# Altium schematic sheet zigbee.SchDoc
size A3
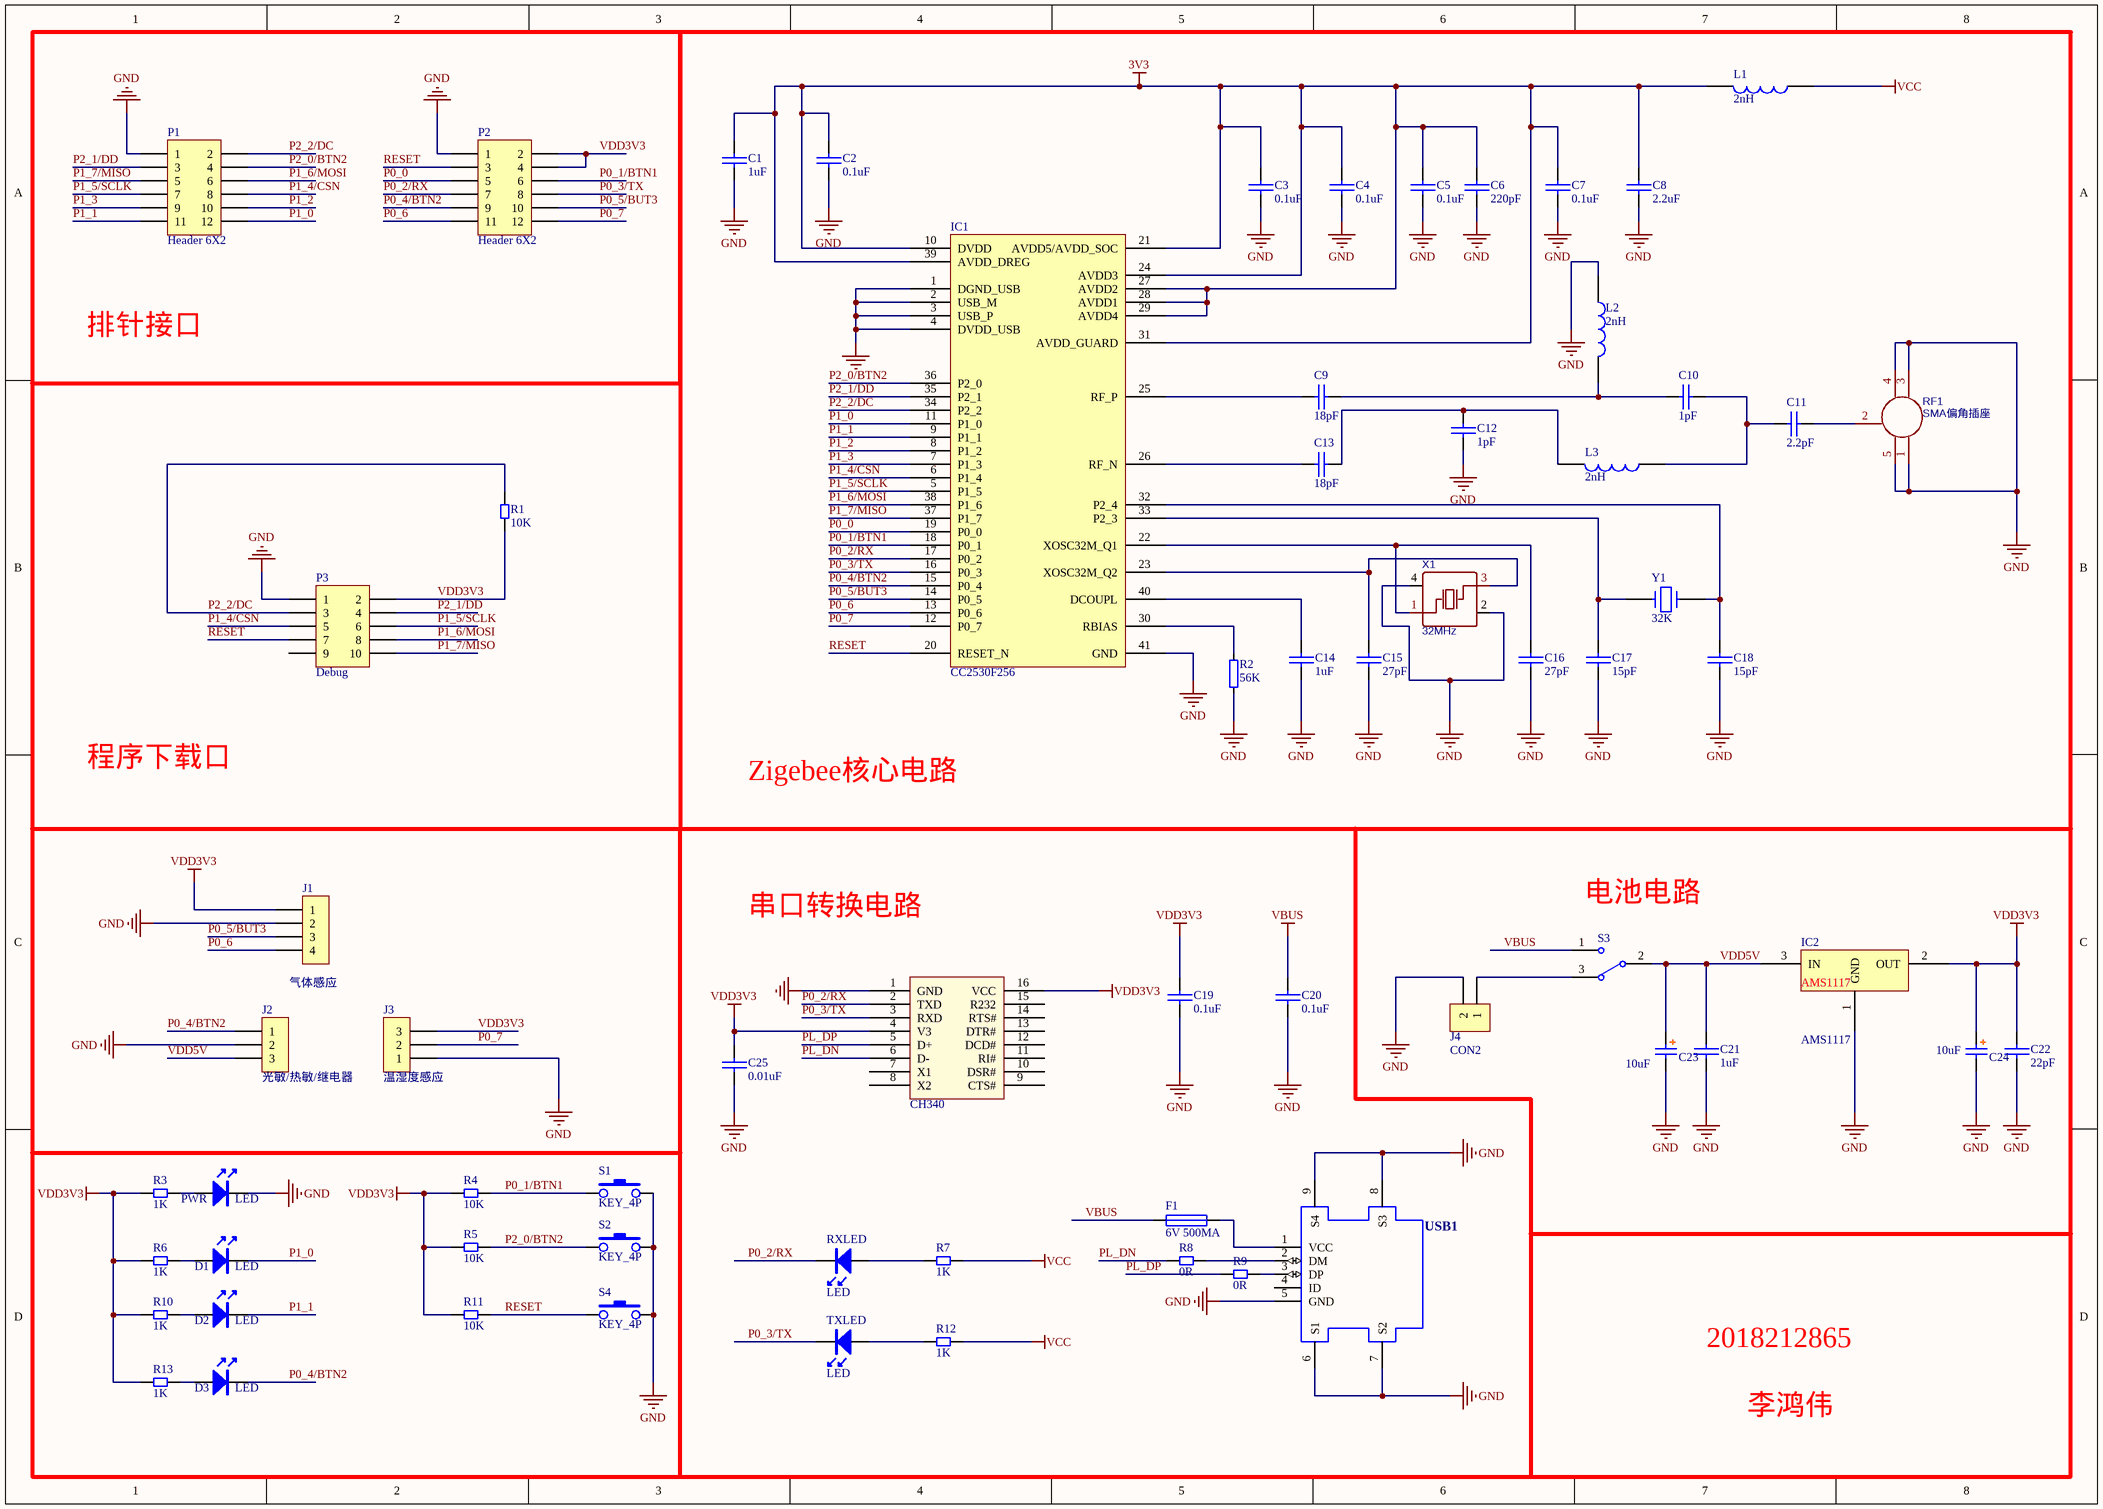
[diagram p0: zigbee.SchDoc]

## Parts
C1  1uF  [C0603]
C2  0.1uF  [C0603]
C3  0.1uF  [C0603]
C4  0.1uF  [C0603]
C5  0.1uF  [C0603]
C6  220pF  [C0603]
C7  0.1uF  [C0603]
C8  2.2uF  [C0603]
C9  18pF  [C0603]
C10  1pF  [C0603]
C11  2.2pF  [C0603]
C12  1pF  [C0603]
C13  18pF  [C0603]
C14  1uF  [C0603]
C15  27pF  [C0603]
C16  27pF  [C0603]
C17  15pF  [C0603]
C18  15pF  [C0603]
C19  0.1uF  [C0603]
C20  0.1uF  [C0603]
C21  1uF  [C0603]
C22  22pF  [C0603]
C23  10uF  [CASE-A_3216]
C24  10uF  [CASE-A_3216]
C25  0.01uF  [C0603]
CH340  CH340G  [SOP16]  (value not drawn)
D1  LED  [LED_0603]
D2  LED  [LED_0603]
D3  LED  [LED_0603]
F1  6V 500MA  [FU 0603]
IC1  CC2530F256  [PVQFN-N40]
IC2  AMS1117  [SOT-223-4]
J1  气体感应  [HDR2.54-M-LI-4P]
J2  光敏/热敏/继电器  [HDR2.54-M-LI-3P]
J3  温湿度感应  [HDR2.54-M-LI-3P]
J4  CON2  [5557-2P]
L1  2nH  [0402]
L2  2nH  [0402]
L3  2nH  [0402]
P1  Header 6X2  [HDR2.54-LI-2x6P]
P2  Header 6X2  [HDR2.54-LI-2x6P]
P3  Debug  [HDR2.54-LI-2x5P]
PWR  LED  [LED_0603]
R1  10K  [R0603]
R2  56K  [R0603]
R3  1K  [R0603]
R4  10K  [R0603]
R5  10K  [R0603]
R6  1K  [R0603]
R7  1K  [R0603]
R8  0R  [R0603]
R9  0R  [R0603]
R10  1K  [R0603]
R11  10K  [R0603]
R12  1K  [R0603]
R13  1K  [R0603]
RF1  SMA偏角插座  [SMA-SMD_HJ-SMA716]
RXLED  LED  [LED_0603]
S1  KEY_4P  [KEY_6*6]
S2  KEY_4P  [KEY_6*6]
S3  SW-SPDT  [SS-12F23]  (value not drawn)
S4  KEY_4P  [KEY_6*6]
TXLED  LED  [LED_0603]
USB1  Mini USB  [SMT-MINI USB]  (value not drawn)
X1  32MHz  [OSC-SMD_4P-L3.2-W2.5-BL]
Y1  32K  [OSC 3215-2P]

## Blocks framed on the sheet
排针接口: P1 P2
Zigebee核心电路: C1-C18 IC1 L1-L3 R2 RF1 X1 Y1

## Nets
3V3: C1.1 C2.1 C3.1 C4.1 C5.1 C6.1 C7.1 C8.1 IC1.10(DVDD) IC1.21(AVDD5/AVDD_SOC) IC1.24(AVDD3) IC1.27(AVDD2) IC1.28(AVDD1) IC1.29(AVDD4) IC1.31(AVDD_GUARD) IC1.39(AVDD_DREG) L1.2
GND: C1.2 C2.2 C3.2 C4.2 C5.2 C6.2 C7.2 C8.2 C12.1 C14.2 C15.2 C16.2 C17.2 C18.2 C19.2 C20.2 C21.2 C22.2 C23.2 C24.2 C25.2 CH340.1(GND) IC1.1(DGND_USB) IC1.2(USB_M) IC1.3(USB_P) IC1.4(DVDD_USB) IC1.41(GND) IC2.1(GND) J1.2 J2.2 J3.1 J4.2 L2.1 P1.1 P2.1 P3.1 PWR.2 R2.1 RF1.1 RF1.3 RF1.4 RF1.5 S1.2 S2.2 S4.2 USB1.5(GND) USB1.6(S1) USB1.7(S2) USB1.8(S3) USB1.9(S4) X1.2(GND) X1.4(GND)
VBUS: C20.1 F1.1 S3.1
VCC: L1.1 R7.2 R12.2
VDD3V3: C19.1 C22.1 C24.1 C25.1 CH340.4(V3) CH340.16(VCC) IC2.2(OUT) J1.1 J3.3 P2.2 P2.4 P3.2 R1.1 R3.1 R4.1 R5.1 R6.1 R10.1 R11.1 R13.1
P0_0: IC1.19(P0_0) P2.5
P0_1/BTN1: IC1.18(P0_1) P2.6 R4.2 S1.1
P0_2/RX: CH340.2(TXD) IC1.17(P0_2) P2.7 RXLED.2
P0_3/TX: CH340.3(RXD) IC1.16(P0_3) P2.8 TXLED.2
P0_4/BTN2: D3.2 IC1.15(P0_4) J2.1 P2.9
P0_5/BUT3: IC1.14(P0_5) J1.3 P2.10
P0_6: IC1.13(P0_6) J1.4 P2.11
P0_7: IC1.12(P0_7) J3.2 P2.12
P1_0: D1.2 IC1.11(P1_0) P1.12
P1_1: D2.2 IC1.9(P1_1) P1.11
P1_2: IC1.8(P1_2) P1.10
P1_3: IC1.7(P1_3) P1.9
P1_4/CSN: IC1.6(P1_4) P1.8 P3.5
P1_5/SCLK: IC1.5(P1_5) P1.7 P3.6
P1_6/MOSI: IC1.38(P1_6) P1.6 P3.8
P1_7/MISO: IC1.37(P1_7) P1.5 P3.10
P2_0/BTN2: IC1.36(P2_0) P1.4 R5.2 S2.1
P2_1/DD: IC1.35(P2_1) P1.3 P3.4
P2_2/DC: IC1.34(P2_2) P1.2 P3.3 R1.2
PL_DN: CH340.6(D-) R8.1
PL_DP: CH340.5(D+) R9.1
RESET: IC1.20(RESET_N) P2.3 P3.7 R11.2 S4.1
VDD5V: C21.1 C23.1 IC2.3(IN) J2.3 S3.2
NetC9_1: C9.1 IC1.25(RF_P)
NetC9_2: C9.2 C10.1 L2.2
NetC10_2: C10.2 C11.2 L3.1
NetC11_1: C11.1 RF1.2
NetC12_2: C12.2 C13.2 L3.2
NetC13_1: C13.1 IC1.26(RF_N)
NetC14_1: C14.1 IC1.40(DCOUPL)
NetC15_1: C15.1 IC1.23(XOSC32M_Q2) X1.3(OSC2)
NetC16_1: C16.1 IC1.22(XOSC32M_Q1) X1.1(OSC1)
NetC17_1: C17.1 IC1.33(P2_3) Y1.1
NetC18_1: C18.1 IC1.32(P2_4) Y1.2
NetD1_1: D1.1 R6.2
NetD2_1: D2.1 R10.2
NetD3_1: D3.1 R13.2
NetF1_2: F1.2 USB1.1(VCC)
NetIC1_30: IC1.30(RBIAS) R2.2
NetJ4_1: J4.1 S3.3
NetPWR_1: PWR.1 R3.2
NetR7_1: R7.1 RXLED.1
NetR8_2: R8.2 USB1.2(DM)
NetR9_2: R9.2 USB1.3(DP)
NetR12_1: R12.1 TXLED.1

Not connected (* = marked no-connect by the designer): CH340 7(X1) 8(X2) 9(CTS#) 10(DSR#) 11(RI#) 12(DCD#) 13(DTR#) 14(RTS#) 15(R232); P3 9; USB1 4(ID)

## Notes on the sheet
- 程序下载口
- 串口转换电路
- (near S3) 电池电路
- 2018212865
- 李鸿伟

## Library data of the parts
C1-C22 C25 = CAP: Capacitor
C23 C24 = Cap Pol2: 钽电容
CH340 = CH340G: 技术支持，联系售后: 封装库来自淘宝卖家 ID：黄晶宝石; 唯一出售店铺网址: https://shop463601444.taobao.com
F1 = FUSE: 保险丝
IC1 = CC2530
J1 = CON4: 连接器
J2 J3 = CON3: 连接器
J4 = CON2: 连接器
L1-L3 = INDUCTOR
P1 P2 = Header 6X2: Header, 6-Pin, Dual row; LatestRevisionDate: 17-Jul-2002; LatestRevisionNote: Re-released for DXP Platform.; Publisher: Altium Limited
P3 = Header 5X2: Header, 5-Pin, Dual row
R1 R3-R13 = RES2
R2 = RES
RF1 = SMA偏角插座: BOM_Manufacturer Part: 间距1.6MM; Contributor: NarcissusLZ; BOM_Supplier Part: https://detail.tmall.com/item.htm?spm=a1z10.3-b.w4011-9244759072.35.2c2a2fb4qDqj1h&id=529515511096&rn=ee1f73c36cd3b95b005e96697d488f37&abbucket=11&skuId=3191543860831; spicePre: R; spiceSymbolName: SMA偏角插座
S1 S2 S4 = KEY_4P: 轻触按键4P
S3 = SW-SPDT: 拨动开关; Published: 24-Mar-1999; LatestRevisionDate: 17-Dec-2003; LatestRevisionNote: Schematic revised, PCB Footprint replaced.; DatasheetVersion: 05-Dec-2000; PackageReference: TL36WW15050; Publisher: Altium Limited; PackageDescription: Switch; 4 Leads; ComponentLink1Description: Manufacturer Link; ComponentLink1URL: http://www.apem.com
USB1 = USB-1: IC; Manufacturer Part Number: USB Plug P/N: MUSB-B5-S-VT-02; Publisher1: Stephen Lui; Publisher2: Tianshen; ComponentLink1Description: Manufacturer Link; ComponentLink1URL: *; Manufacturer: *; Published: NOV.13,2009
X1 = 32MHz: BOM_Manufacturer Part: 32Mhz (5个); nameAlias: Frequency; BOM_Supplier Part: https://detail.tmall.com/item.htm?spm=a1z10.3-b-s.w4011-21581912015.62.25615535szrVfW&id=524364517124&rn=6fc20a06caf5be9e882cd070f02ad4b3&abbucket=11&skuId=3184916323459; spicePre: X; spiceSymbolName: X322532MOB4SI
Y1 = CRYSTAL